# Altium project mLRSrxtx.PrjPcb
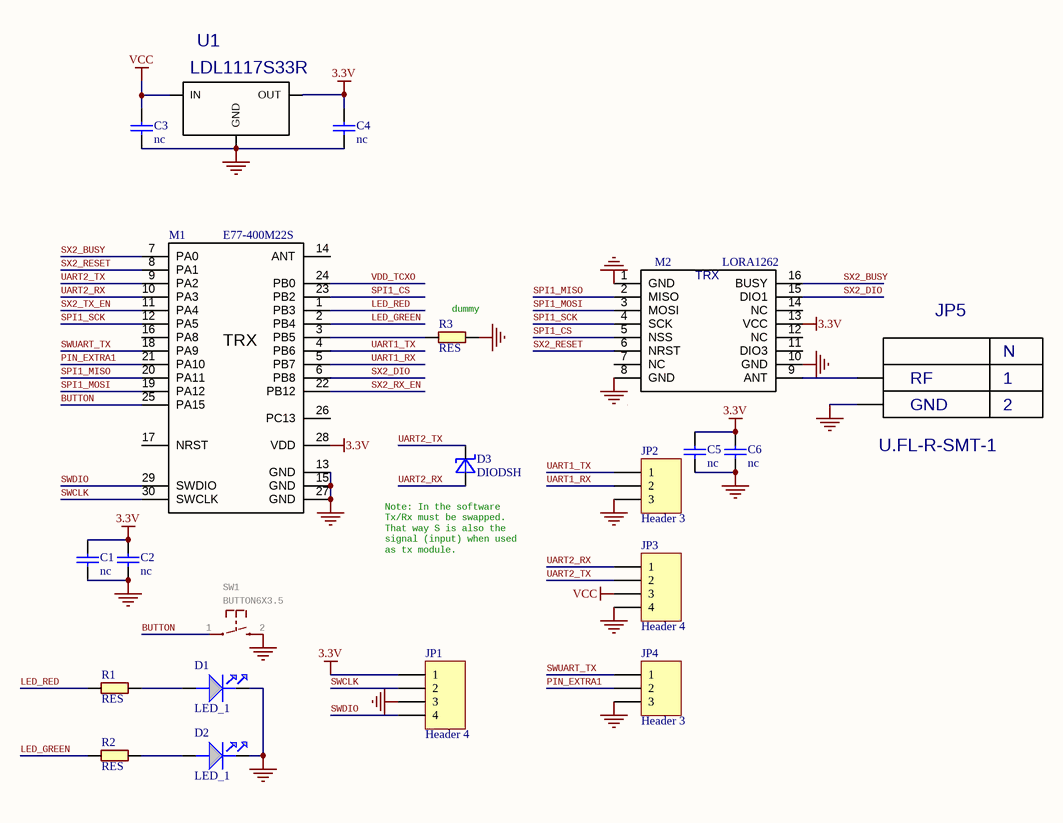
[diagram p0: mLRStxtx.SchDoc]
1 sheet, 21 parts. Net scope: global (net labels, ports and power ports of the same name join across sheets).
Board file: mLRSrxtx.PcbDoc

## Sheet mLRStxtx.SchDoc
size A4; SheetNumber: 1; SheetTotal: 1

### Parts
C1  nc  [C-0603]
C2  nc  [C-0603]
C3  nc  [C-0805]
C4  nc  [C-0805]
C5  nc  [C-0603]
C6  nc  [C-0603]
D1  LED_1  [LED_0805]
D2  LED_1  [LED_0805]
D3  DIODSH  [SOD-323]
JP1  Header 4  [HDR1X4]
JP2  Header 3  [HDR1X3]
JP3  Header 4  [HDR1X4]
JP4  Header 3  [HDR1X3]
JP5  U.FL-R-SMT-1  [U.FL-R-SMT-1]
M1  E77-400M22S  [E77XX-M22]
M2  LORA1262  [LGA16_LORA1280]
R1  RES  [R-0603]
R2  RES  [R-0603]
R3  RES  [R-0603]
SW1  BUTTON6X3.5  [BUTTON-THT]
U1  LDL1117S33R  [SOT223]

### Nets
3.3V: C1.1 C2.1 C4.1 C5.1 C6.1 JP1.1 M1.28(VDD) M2.13(VCC) U1.2(OUT)
GND: C1.2 C2.2 C3.2 C4.2 C5.2 C6.2 D1.K(CATHODE) D2.K(CATHODE) JP1.3 JP2.3 JP3.4 JP4.3 JP5.2 M1.13(GND) M1.15(GND) M1.27(GND) M2.1(GND) M2.8(GND) M2.10(GND) R3.1 SW1.2 U1.1(GND)
VCC: C3.1 JP3.3 U1.3(IN)
BUTTON: M1.25(PA15) SW1.1
LED_GREEN: M1.2(PB4) R2.2
LED_RED: M1.1(PB3) R1.2
PIN_EXTRA1: JP4.2 M1.21(PA10)
SPI1_CS: M1.23(PB2) M2.5(NSS)
SPI1_MISO: M1.20(PA11) M2.2(MISO)
SPI1_MOSI: M1.19(PA12) M2.3(MOSI)
SPI1_SCK: M1.12(PA5) M2.4(SCK)
SWCLK: JP1.2 M1.30(SWCLK)
SWDIO: JP1.4 M1.29(SWDIO)
SWUART_TX: JP4.1 M1.18(PA9)
SX2_BUSY: M1.7(PA0) M2.16(BUSY)
SX2_DIO: M1.6(PB8) M2.15(DIO1)
SX2_RESET: M1.8(PA1) M2.6(NRST)
SX2_RX_EN: M1.22(PB12)
SX2_TX_EN: M1.11(PA4)
UART1_RX: JP2.2 M1.5(PB7)
UART1_TX: JP2.1 M1.4(PB6)
UART2_RX: D3.1 JP3.1 M1.10(PA3)
UART2_TX: D3.2 JP3.2 M1.9(PA2)
VDD_TCXO: M1.24(PB0)
NetD1_A: D1.A(ANODE) R1.1
NetD2_A: D2.A(ANODE) R2.1
NetJP5_1: JP5.1 M2.9(ANT)
NetM1_3: M1.3(PB5) R3.2

Not connected (* = marked no-connect by the designer): M1 14(ANT) 16(PA8) 17(NRST) 26(PC13); M2 7(NC) 11(DIO3) 12(NC) 14(NC); U1 4

### Notes on the sheet
- (near R3) dummy
- (near D3) Note: In the software
  Tx/Rx must be swapped.
  That way S is also the
  signal (input) when used
  as tx module.
- (in symbol E77-400M22S) TRX
- (in symbol LORA1262) TRX
- (in symbol U.FL-R-SMT-1) N; RF; GND

### Library data of the parts
C1-C6 = CAPN: Voltage: 50V; Точність/група: NP0; Вид: Конденсатор
D1 D2 = LED_1: Вид: Світлодіод
D3 = DIODSH: Вид: Діод
JP1 JP3 = Header 4: Header, 4-Pin; LatestRevisionDate: 17-Jul-2002; LatestRevisionNote: Re-released for DXP Platform.; Publisher: Altium Limited
JP2 JP4 = Header 3: Header, 3-Pin; LatestRevisionDate: 17-Jul-2002; LatestRevisionNote: Re-released for DXP Platform.; Publisher: Altium Limited
JP5 = U.FL-R-SMT-1: Value: {Value}; Mounting  Method: SMD
R1-R3 = RES: Точність/група: 5%; Вид: Резистор
SW1 = BUTTON6X3.5: GateName_1: G$1; SymbolName_1: BUTTON; DeviceName: 6X3.5; LibraryName: # stdlib; DeviceSetName: BUTTON
U1 = LDL1117S33R: Value: {Value}; Mounting  Method: SMD